# EAGLE design sensor-dual (EAGLE 7.5.0)
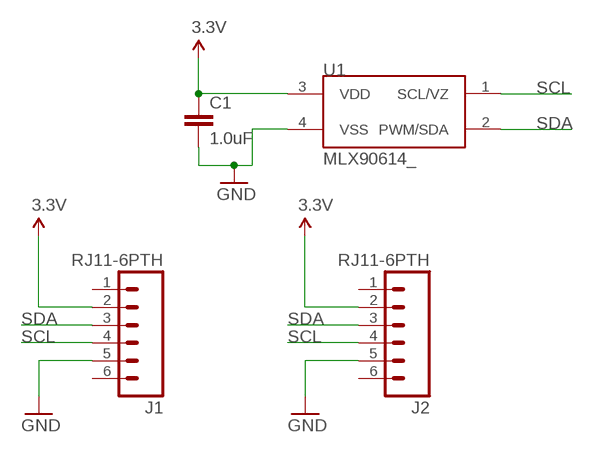
[diagram p0: schematic, sheet 1]

## Parts
C1  1.0uF  1.0UF-25V-+80/-20(0805)  [0805]
J1  RJ11-6PTH  [RJ11-6]
J2  RJ11-6PTH  [RJ11-6]
U1  MLX90614_  [TO-39]

## Nets
3.3V: C1.1 J1.2 J2.2 U1.3(VDD)
GND: C1.2 J1.5 J2.5 U1.4(VSS)
SCL: J1.4 J2.4 U1.1(SCL/VZ)
SDA: J1.3 J2.3 U1.2(PWM/SDA)
Unconnected: J1.1 J1.6 J2.1 J2.6

## Library data of the parts
C1 = SparkFun-Capacitors:1.0UF-25V-+80/-20(0805): CAP-11625; PROD_ID: CAP-11625
J1 J2 = synfinatic:RJ11-6: RJ11 Jack Simple 6 pin RJ11 jack. Commonly found on CAT3 devices and Microchip programmers. SKU: PRT-00132 AKA: Assmann WSW Components A-2004-0-4-LP-N-R http://www.digikey.com/scripts/DkSearch/dksus.dll?Detail&itemSeq=188493072&uq=635893574606648195
U1 = SparkFun-Sensors:MLX90614: Non-contact PIR I2C interface temperature sensor

## Board
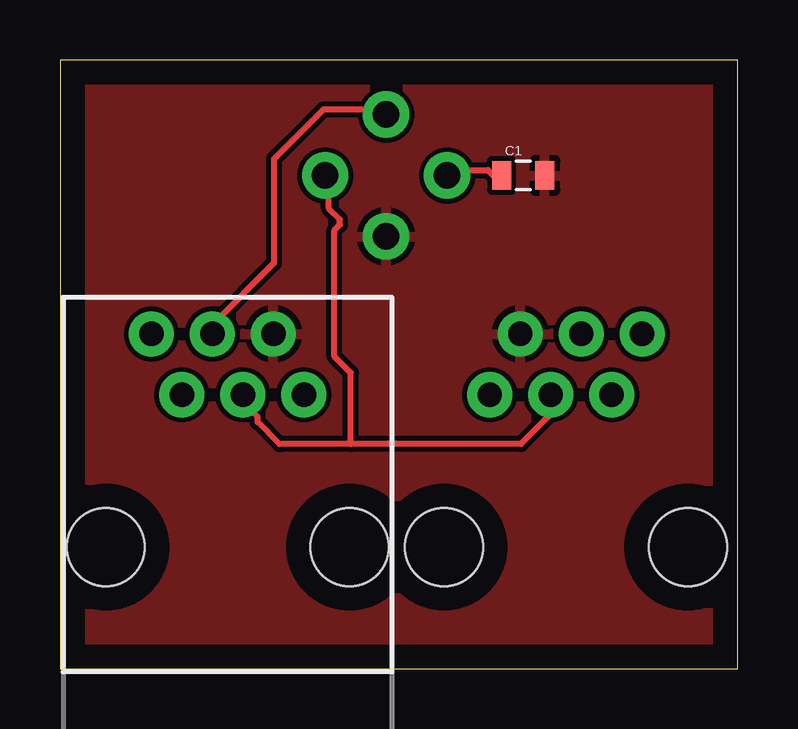
[diagram p1: board, top side]
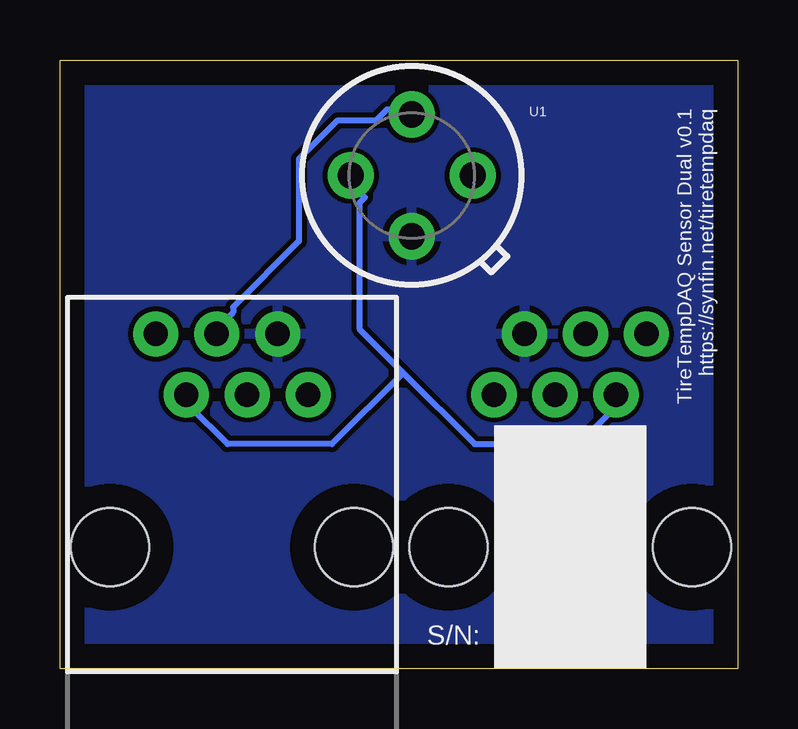
[diagram p2: board, bottom side, seen from below]

Size 28.25 x 25.39 mm. Coordinates in mm from the lower left corner, seen from the top.
Outline: 0,0 28.25,0 28.25,25.39 0,25.39 0,0
Copper layers (1*16): Top 0.035mm / dielectric 1.5mm / Bottom 0.035mm
Design rules "default": minimum track width 10mil, minimum drill 24mil, track to track 8mil, track to pad 8mil, pad to pad 8mil, via to via 8mil, smd to smd 8mil, copper to edge 40mil, drill to drill 8mil, minimum pad ring 10mil, minimum via ring 8mil, stop-mask expansion 4mil, vias tented up to drill 0mil, thermal gap 10mil

### Footprints (pad centres in the part's own frame; a part is rotated, then mirrored left to right if it is on the bottom)
0805 = smd 0.8 x 1.2: 1 -0.9,0; 2 0.9,0
RJ11-6 = drill 1.016 pad 1.88: 1 1.905,8.89; 2 3.175,6.35; 3 4.445,8.89; 4 5.715,6.35; 5 6.985,8.89; 6 8.255,6.35 | hole 3.251: 0,0; 10.16,0
TO-39 = drill 1.1 pad 1.93: 1 2.54,0; 2 0,2.54; 3 -2.54,0; 4 0,-2.54

### Placement (x,y rotation side)
C1  19.3,20.57 0 top
J1  1.91,5.08 0 top
J2  26.16,5.08 0 bottom
U1  13.59,20.57 0 bottom

### Tracks (layer width: path | path; a pad name or v marks a point on that pad's centre or on a via)
3.3V
  Top 0.254: C1.1 18.06,20.57 17.83,20.8 16.46,20.8 16.23,20.57 U1.3
  Bottom 0.254: 13.95,12.34 15.77,14.17 15.77,19.43 15.54,19.66 16,20.12 16,20.57 U1.3 | 13.95,12.34 10.97,9.37 6.63,9.37 5.26,10.74 5.26,11.43 J1.2 | 13.95,12.34 16.92,9.37 21.26,9.37 22.86,10.97 22.86,11.43 J2.2
GND
  pour Bottom: 0.25,25.15 27.69,25.15 27.69,0.25 0.25,0.25
  pour Top: 0.51,24.89 27.69,24.89 27.69,0.25 0.51,0.25
SCL
  Top 0.254: 12.12,9.37 19.2,9.37 20.34,10.52 20.34,11.43 J2.4 | 12.12,9.37 9.14,9.37 8.23,10.29 8.23,10.52 7.77,10.97 7.77,11.43 J1.4 | 12.12,9.37 12.12,12.34 11.43,13.03 11.43,18.29 11.66,18.52 11.66,18.75 11.2,19.2 11.2,20.57 U1.1
SDA
  Top 0.254: J1.3 6.4,14.17 6.4,14.4 8.91,16.92 8.91,21.26 10.97,23.32 13.49,23.32 U1.2
  Bottom 0.254: J2.3 21.72,14.17 21.03,14.86 21.03,15.09 18.29,17.83 18.29,21.26 16.69,22.86 15.09,22.86 14.63,23.32 13.72,23.32 U1.2

### Text on the board
bNames: TireTempDAQ Sensor Dual v0.1 / https://synfin.net/tiretempdaq | S/N: